# Altium schematic sheet LED.SchDoc
size A4
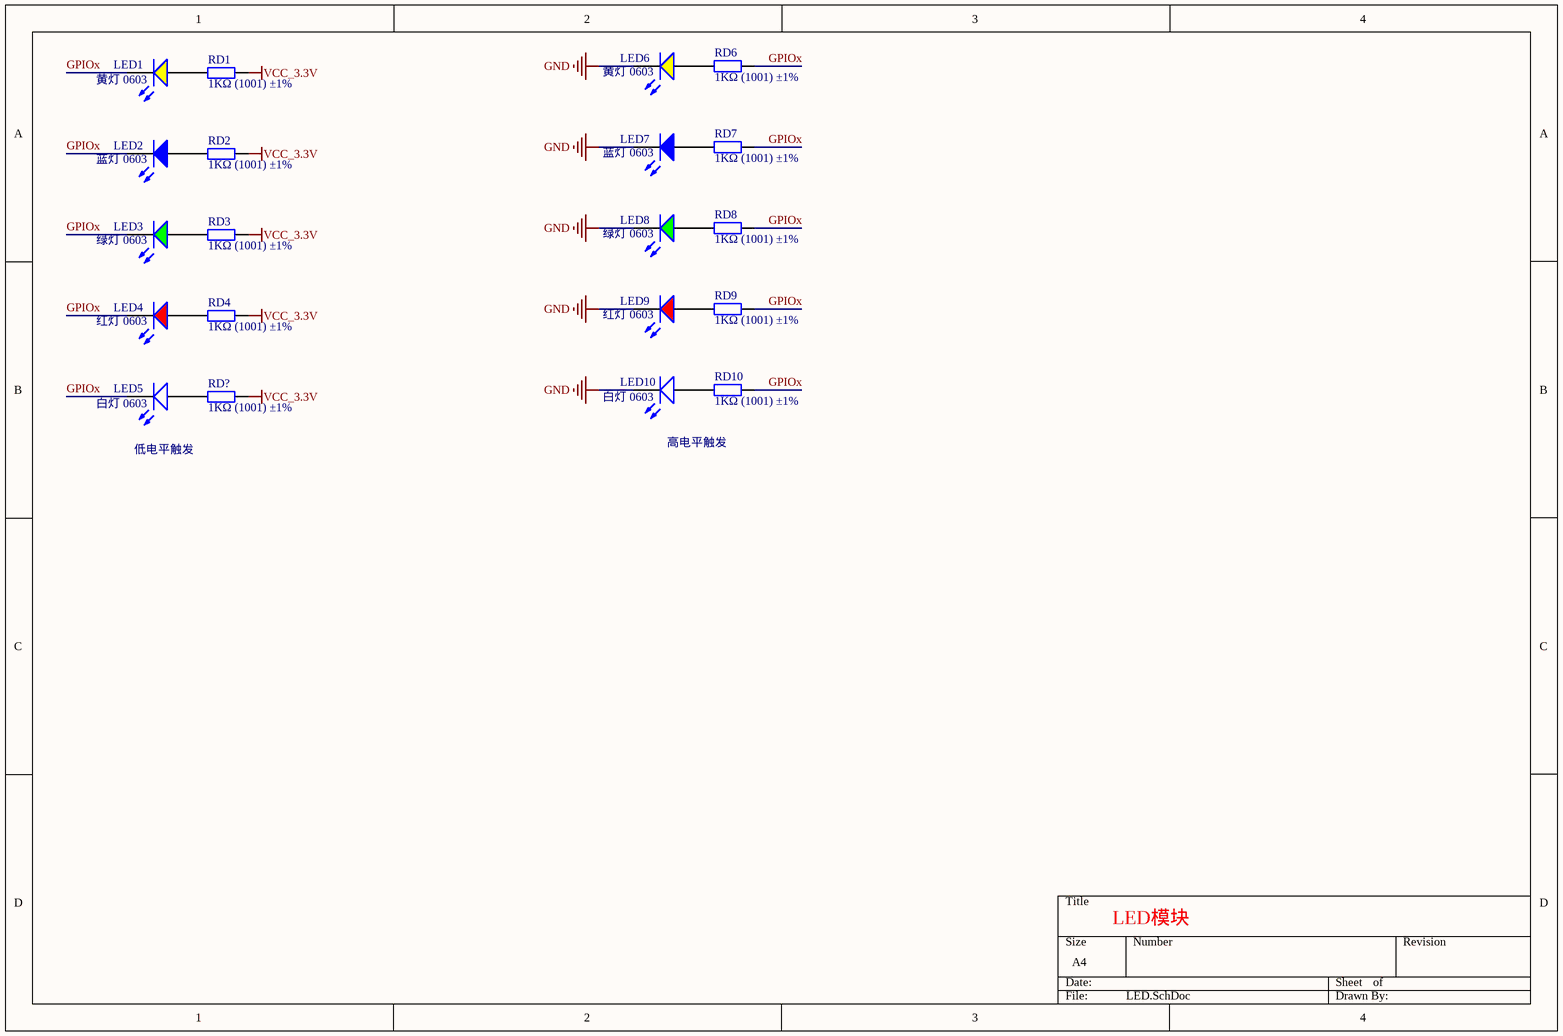
[diagram p0: LED.SchDoc]

## Parts
LED1  黄灯 0603  [LED_0603_Y]
LED2  蓝灯 0603  [LED_0603_B]
LED3  绿灯 0603  [LED_0603_G]
LED4  红灯 0603  [LED_0603_R]
LED5  白灯 0603  [LED_0603_W]
LED6  黄灯 0603  [LED_0603_Y]
LED7  蓝灯 0603  [LED_0603_B]
LED8  绿灯 0603  [LED_0603_G]
LED9  红灯 0603  [LED_0603_R]
LED10  白灯 0603  [LED_0603_W]
RD1  1KΩ (1001) ±1%  [RESC_0603_2]
RD2  1KΩ (1001) ±1%  [RESC_0603_2]
RD3  1KΩ (1001) ±1%  [RESC_0603_2]
RD4  1KΩ (1001) ±1%  [RESC_0603_2]
RD6  1KΩ (1001) ±1%  [RESC_0603_2]
RD7  1KΩ (1001) ±1%  [RESC_0603_2]
RD8  1KΩ (1001) ±1%  [RESC_0603_2]
RD9  1KΩ (1001) ±1%  [RESC_0603_2]
RD10  1KΩ (1001) ±1%  [RESC_0603_2]
RD?  1KΩ (1001) ±1%  [RESC_0603_2]

## Nets
GND: LED6.2 LED7.2 LED8.2 LED9.2 LED10.2
VCC_3.3V: RD1.2 RD2.2 RD3.2 RD4.2 RD?.2
GPIOx: LED1.2 LED2.2 LED3.2 LED4.2 LED5.2 RD6.2 RD7.2 RD8.2 RD9.2 RD10.2
NetLED1_1: LED1.1 RD1.1
NetLED2_1: LED2.1 RD2.1
NetLED3_1: LED3.1 RD3.1
NetLED4_1: LED4.1 RD4.1
NetLED5_1: LED5.1 RD?.1
NetLED6_1: LED6.1 RD6.1
NetLED7_1: LED7.1 RD7.1
NetLED8_1: LED8.1 RD8.1
NetLED9_1: LED9.1 RD9.1
NetLED10_1: LED10.1 RD10.1

## Notes on the sheet
- 高电平触发
- 低电平触发
- LED模块

## Library data of the parts
LED1 LED6 = 0603 黄灯: 发光二极管; ComponentLink1Description: 供应商链接; ComponentLink1URL: http://www.szlcsc.com/product/details_73147.html; Package: 0603; Supplier: LC; SuppliersPartNumber: C72038
LED2 LED7 = 0603 蓝灯: 发光二极管; ComponentLink1Description: 供应商链接; ComponentLink1URL: http://www.szlcsc.com/product/details_73150.html; Package: 0603; Supplier: LC; SuppliersPartNumber: C72041
LED3 LED8 = 0603 绿灯: 发光二极管; ComponentLink1Description: 供应商链接; ComponentLink1URL: http://www.szlcsc.com/product/details_73152.html; Package: 0603; Supplier: LC; SuppliersPartNumber: C72043
LED4 LED9 = 0603 红灯: 发光二极管; ComponentLink1Description: 供应商链接; ComponentLink1URL: http://www.szlcsc.com/product/details_2659.html; Package: 0603; Supplier: LC; SuppliersPartNumber: C2286
LED5 LED10 = 0603 白灯: 发光二极管; ComponentLink1Description: 供应商链接; ComponentLink1URL: http://www.szlcsc.com/product/details_2663.html; Package: 0603; Supplier: LC; SuppliersPartNumber: C2290
RD1-RD4 RD6-RD10 RD? = 0603 1KΩ (1001) 1%: 贴片电阻; ComponentLink1Description: 供应商链接; ComponentLink1URL: http://www.szlcsc.com/product/details_21904.html; Package: 0603; Supplier: LC; SuppliersPartNumber: C21190